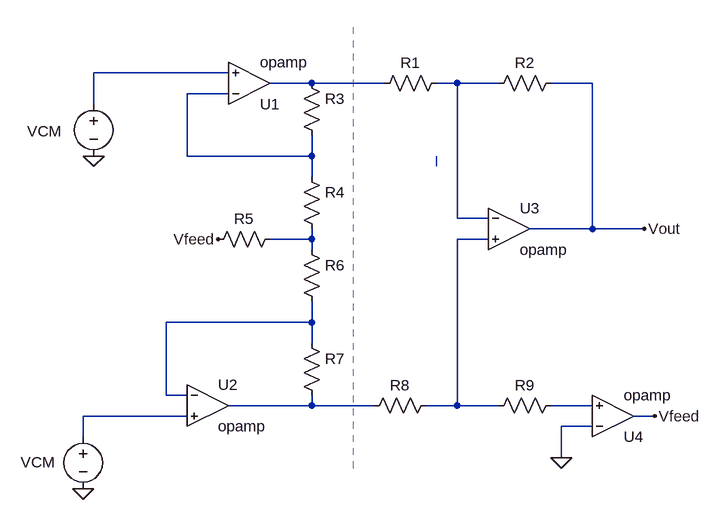
[diagram p0: schematic Draft1.asc]
Draft1.asc, the LTspice schematic file:
Version 4
SHEET 1 996 680
WIRE 48 -160 -160 -160
WIRE 176 -144 112 -144
WIRE 288 -144 176 -144
WIRE 400 -144 368 -144
WIRE 464 -144 400 -144
WIRE 608 -144 544 -144
WIRE 48 -128 -16 -128
WIRE -160 -112 -160 -160
WIRE -16 -32 -16 -128
WIRE 176 -32 176 -64
WIRE 176 -32 -16 -32
WIRE 176 0 176 -32
WIRE 400 64 400 -144
WIRE 448 64 400 64
WIRE 608 80 608 -144
WIRE 608 80 512 80
WIRE 688 80 608 80
WIRE 176 96 176 80
WIRE 176 96 112 96
WIRE 448 96 400 96
WIRE 176 112 176 96
WIRE 176 224 176 192
WIRE 176 224 -48 224
WIRE 176 256 176 224
WIRE -48 336 -48 224
WIRE -16 336 -48 336
WIRE 176 352 176 336
WIRE 176 352 48 352
WIRE 272 352 176 352
WIRE 400 352 400 96
WIRE 400 352 352 352
WIRE 464 352 400 352
WIRE 608 352 544 352
WIRE -16 368 -176 368
WIRE 704 368 672 368
WIRE 608 384 560 384
WIRE -176 400 -176 368
WIRE 560 432 560 384
FLAG 560 432 0
FLAG 704 368 Vfeed
FLAG 32 96 Vfeed
FLAG -176 480 0
FLAG -160 -32 0
FLAG 688 80 Vout
SYMBOL Opamps\\opamp 80 -80 M180
SYMATTR InstName U1
SYMBOL Opamps\\opamp 16 288 R0
SYMATTR InstName U2
SYMBOL Opamps\\opamp 480 16 R0
SYMATTR InstName U3
SYMBOL Opamps\\opamp 640 432 M180
SYMATTR InstName U4
SYMBOL res 160 -16 R0
SYMATTR InstName R4
SYMATTR Value ""
SYMBOL res 160 96 R0
SYMATTR InstName R6
SYMATTR Value ""
SYMBOL res 160 240 R0
SYMATTR InstName R7
SYMATTR Value ""
SYMBOL res 160 -160 R0
SYMATTR InstName R3
SYMATTR Value ""
SYMBOL res 384 -160 R90
WINDOW 0 0 56 VBottom 2
WINDOW 3 32 56 VTop 2
SYMATTR InstName R1
SYMATTR Value ""
SYMBOL res 560 -160 R90
WINDOW 0 0 56 VBottom 2
WINDOW 3 32 56 VTop 2
SYMATTR InstName R2
SYMATTR Value ""
SYMBOL res 368 336 R90
WINDOW 0 0 56 VBottom 2
WINDOW 3 32 56 VTop 2
SYMATTR InstName R8
SYMATTR Value ""
SYMBOL res 128 80 R90
WINDOW 0 0 56 VBottom 2
WINDOW 3 32 56 VTop 2
SYMATTR InstName R5
SYMATTR Value ""
SYMBOL res 560 336 R90
WINDOW 0 0 56 VBottom 2
WINDOW 3 32 56 VTop 2
SYMATTR InstName R9
SYMATTR Value ""
SYMBOL voltage -160 -128 R0
WINDOW 0 -102 58 Left 2
WINDOW 123 0 0 Left 0
WINDOW 39 0 0 Left 0
SYMATTR InstName VCM
SYMATTR Value ""
SYMBOL voltage -176 384 R0
WINDOW 0 -96 55 Left 2
WINDOW 123 0 0 Left 0
WINDOW 39 0 0 Left 0
SYMATTR InstName VCM
SYMATTR Value ""
LINE Normal 240 448 240 -240 1
CIRCLE Normal 368 -16 368 -32 1

The netlist it stands for:
* Draft1.asc
XU1 N004 N001 N002 opamp Aol=100K GBW=10Meg  ; pins invin noninvin out
XU2 N007 N010 N008 opamp Aol=100K GBW=10Meg  ; pins invin noninvin out
XU3 N003 N006 Vout opamp Aol=100K GBW=10Meg  ; pins invin noninvin out
XU4 0 N009 Vfeed opamp Aol=100K GBW=10Meg  ; pins invin noninvin out
R4 N004 N005
R6 N005 N007
R7 N007 N008
R3 N002 N004
R1 N003 N002
R2 Vout N003
R8 N006 N008
R5 N005 Vfeed
R9 N009 N006
VCM N001 0
VCM N010 0
.backanno
.end